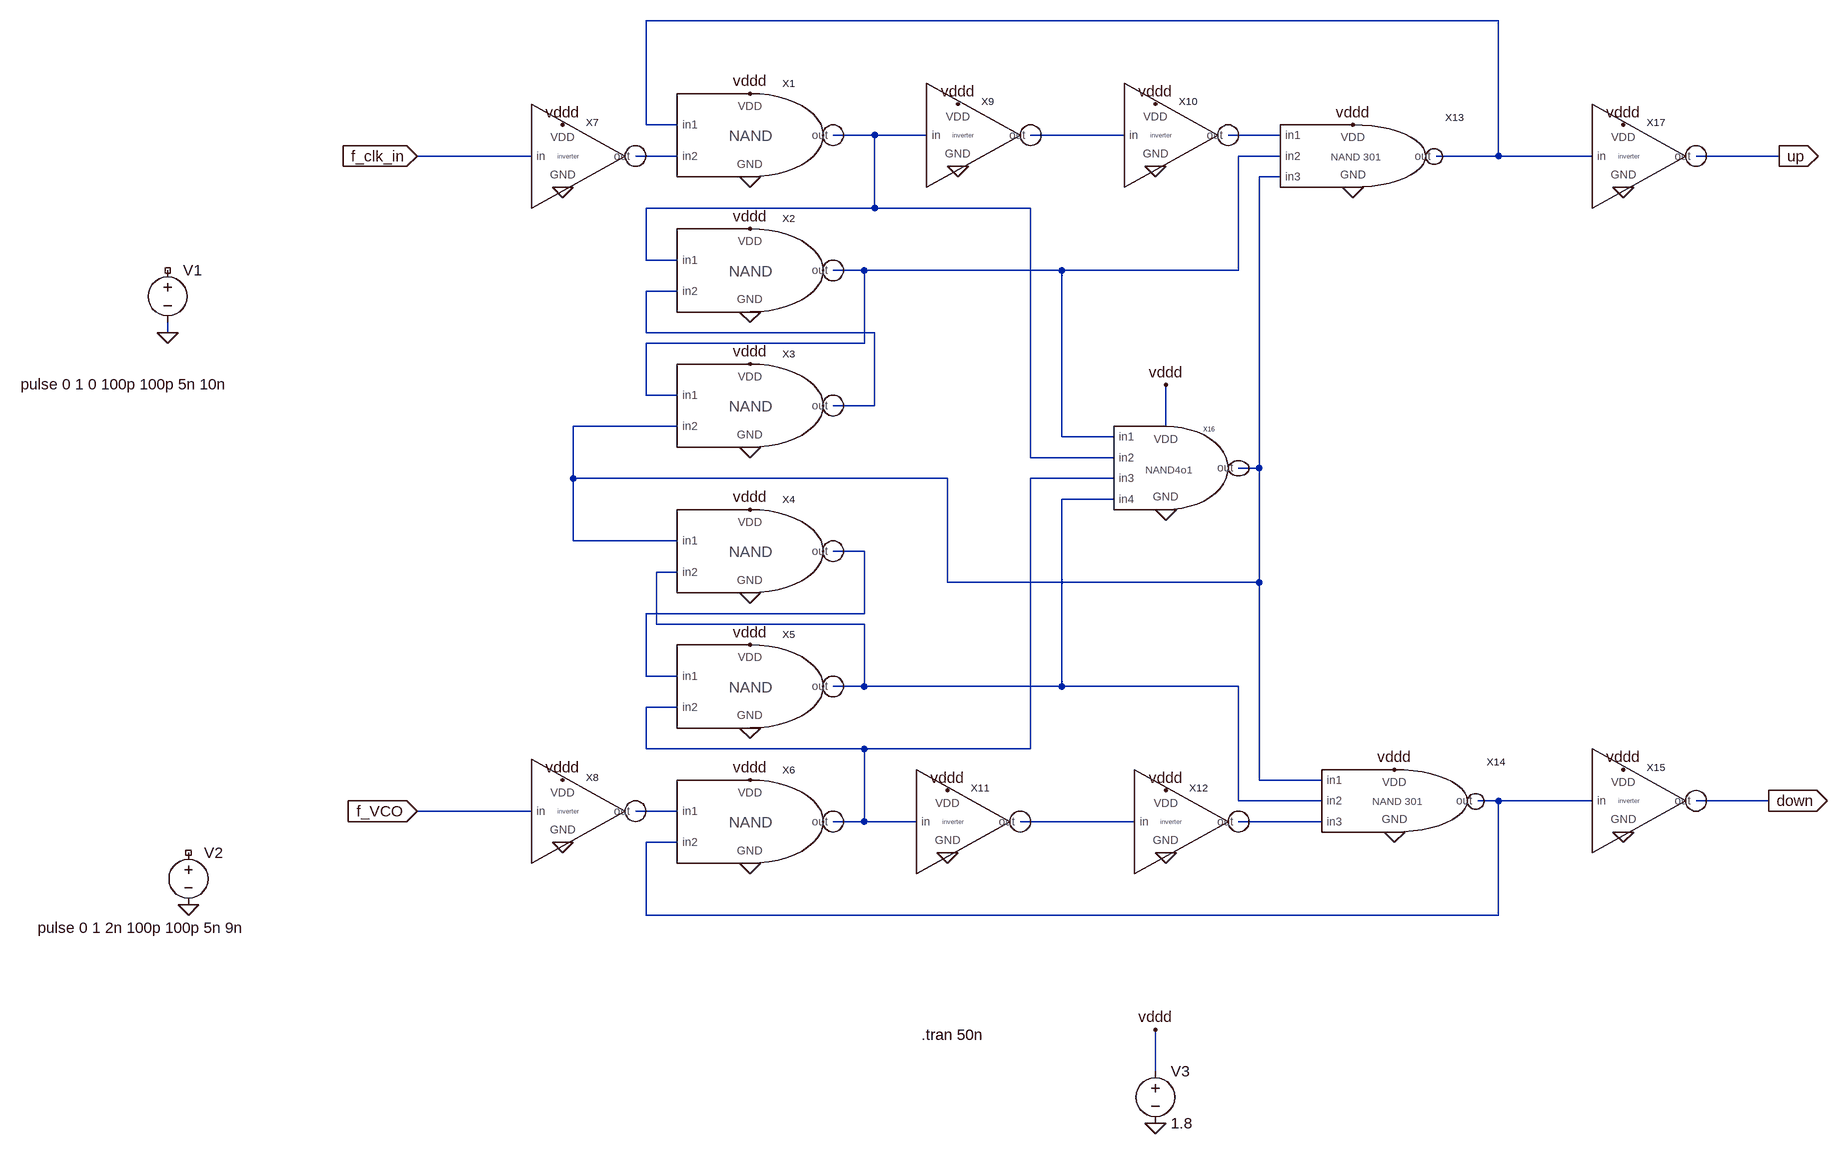
[diagram p0: schematic pfd_501.asc]
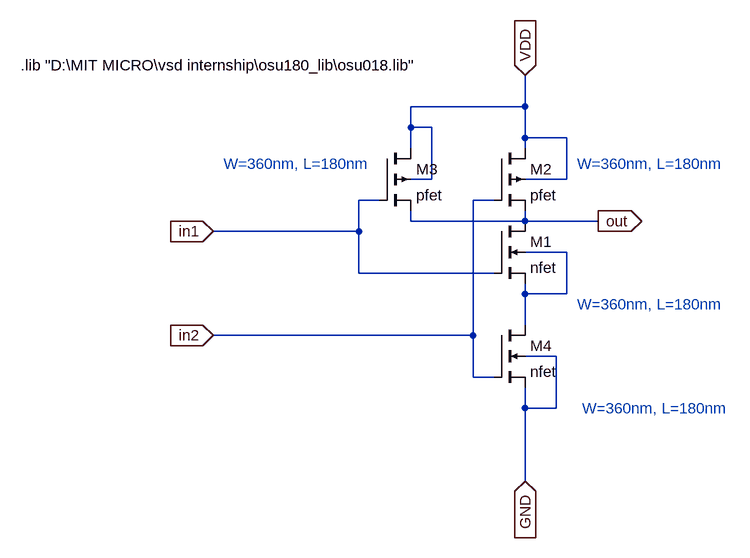
[diagram p1: sub-circuit nand101.asc]
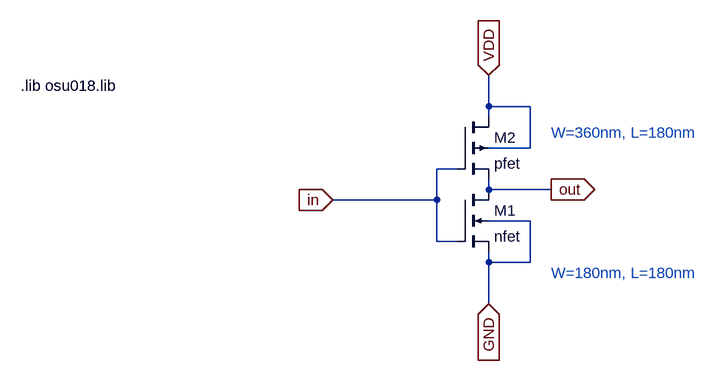
[diagram p2: sub-circuit inv101.asc]
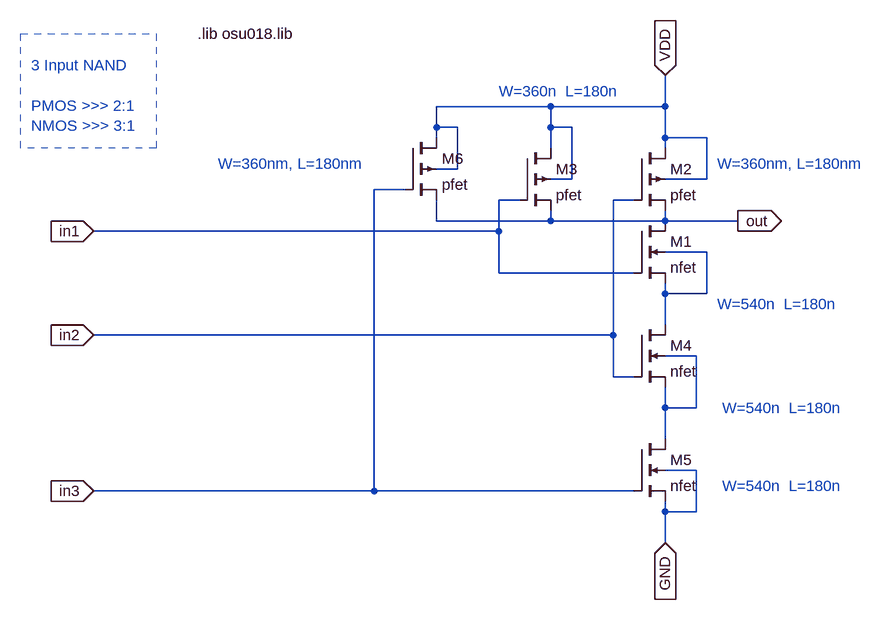
[diagram p3: sub-circuit nand301.asc]
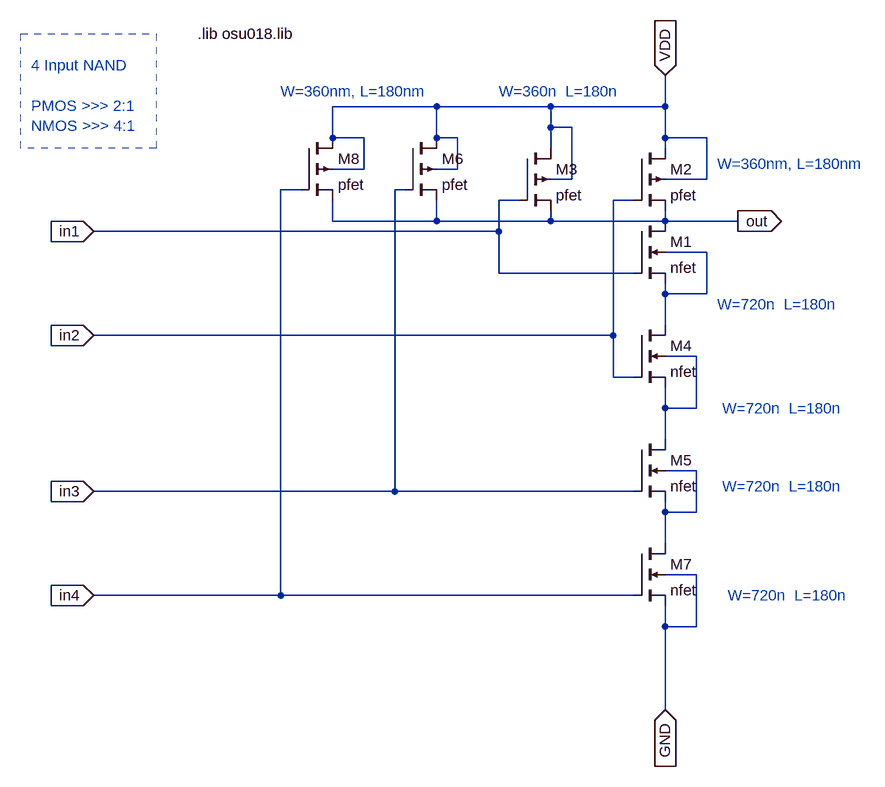
[diagram p4: sub-circuit nand401.asc]
pfd_501.asc, the LTspice schematic file:
Version 4
SHEET 1 2504 1444
WIRE 1248 -272 -64 -272
WIRE -64 -112 -64 -272
WIRE -16 -112 -64 -112
WIRE 288 -96 224 -96
WIRE 368 -96 288 -96
WIRE 672 -96 528 -96
WIRE 912 -96 832 -96
WIRE -240 -64 -416 -64
WIRE -16 -64 -80 -64
WIRE 912 -64 848 -64
WIRE 1248 -64 1248 -272
WIRE 1248 -64 1152 -64
WIRE 1392 -64 1248 -64
WIRE 1680 -64 1552 -64
WIRE 912 -32 880 -32
WIRE 288 16 288 -96
WIRE 288 16 -64 16
WIRE 528 16 288 16
WIRE -64 96 -64 16
WIRE -16 96 -64 96
WIRE 272 112 224 112
WIRE 576 112 272 112
WIRE 848 112 848 -64
WIRE 848 112 576 112
WIRE -16 144 -64 144
WIRE -800 208 -800 192
WIRE -64 208 -64 144
WIRE 288 208 -64 208
WIRE 272 224 272 112
WIRE 272 224 -64 224
WIRE -64 304 -64 224
WIRE -16 304 -64 304
WIRE 288 320 288 208
WIRE 288 320 224 320
WIRE -16 352 -176 352
WIRE 736 352 736 288
WIRE 576 368 576 112
WIRE 656 368 576 368
WIRE 528 400 528 16
WIRE 656 400 528 400
WIRE 880 416 880 -32
WIRE 880 416 848 416
WIRE -176 432 -176 352
WIRE 400 432 -176 432
WIRE 656 432 528 432
WIRE 656 464 576 464
WIRE -176 528 -176 432
WIRE -16 528 -176 528
WIRE 272 544 224 544
WIRE -16 576 -48 576
WIRE 400 592 400 432
WIRE 880 592 880 416
WIRE 880 592 400 592
WIRE 272 640 272 544
WIRE 272 640 -64 640
WIRE -48 656 -48 576
WIRE 272 656 -48 656
WIRE -64 736 -64 640
WIRE -16 736 -64 736
WIRE 272 752 272 656
WIRE 272 752 224 752
WIRE 576 752 576 464
WIRE 576 752 272 752
WIRE 848 752 576 752
WIRE -16 784 -64 784
WIRE -64 848 -64 784
WIRE 272 848 -64 848
WIRE 528 848 528 432
WIRE 528 848 272 848
WIRE 880 896 880 592
WIRE 976 896 880 896
WIRE 848 928 848 752
WIRE 976 928 848 928
WIRE 1248 928 1216 928
WIRE 1392 928 1248 928
WIRE 1664 928 1552 928
WIRE -240 944 -416 944
WIRE -16 944 -80 944
WIRE 272 960 272 848
WIRE 272 960 224 960
WIRE 352 960 272 960
WIRE 688 960 512 960
WIRE 976 960 848 960
WIRE -16 992 -64 992
WIRE -64 1104 -64 992
WIRE 1248 1104 1248 928
WIRE 1248 1104 -64 1104
WIRE 720 1344 720 1280
FLAG -416 -64 f_clk_in
IOPIN -416 -64 In
FLAG -416 944 f_VCO
IOPIN -416 944 In
FLAG 1680 -64 up
IOPIN 1680 -64 Out
FLAG 1664 928 down
IOPIN 1664 928 Out
FLAG -800 208 0
FLAG -768 1088 0
FLAG 1440 -16 0
FLAG 1024 -16 0
FLAG 720 -48 0
FLAG 416 -48 0
FLAG 96 -32 0
FLAG 96 176 0
FLAG 96 384 0
FLAG 96 608 0
FLAG -192 -16 0
FLAG 96 816 0
FLAG 96 1024 0
FLAG 400 1008 0
FLAG 736 1008 0
FLAG 1088 976 0
FLAG 1440 976 0
FLAG -192 992 0
FLAG -192 -112 vddd
FLAG 96 -160 vddd
FLAG 416 -144 vddd
FLAG 720 -144 vddd
FLAG 96 48 vddd
FLAG 1024 -112 vddd
FLAG 1440 -112 vddd
FLAG 736 288 vddd
FLAG 96 256 vddd
FLAG 96 480 vddd
FLAG 96 688 vddd
FLAG 96 896 vddd
FLAG 400 912 vddd
FLAG 736 912 vddd
FLAG 1088 880 vddd
FLAG -192 896 vddd
FLAG 1440 880 vddd
FLAG 720 1424 0
FLAG 720 1280 vddd
FLAG 736 480 0
SYMBOL nand101 64 -96 R0
SYMATTR InstName X1
SYMBOL nand101 64 112 R0
SYMATTR InstName X2
SYMBOL nand101 64 320 R0
SYMATTR InstName X3
SYMBOL nand101 64 544 R0
SYMATTR InstName X4
SYMBOL nand101 64 752 R0
SYMATTR InstName X5
SYMBOL nand101 64 960 R0
SYMATTR InstName X6
SYMBOL inv101 -192 -64 R0
SYMATTR InstName X7
SYMBOL inv101 -192 944 R0
SYMATTR InstName X8
SYMBOL inv101 416 -96 R0
SYMATTR InstName X9
SYMBOL inv101 720 -96 R0
SYMATTR InstName X10
SYMBOL inv101 400 960 R0
SYMATTR InstName X11
SYMBOL inv101 736 960 R0
SYMATTR InstName X12
SYMBOL nand301 976 -64 R0
SYMATTR InstName X13
SYMBOL nand301 1040 928 R0
SYMATTR InstName X14
SYMBOL inv101 1440 928 R0
SYMATTR InstName X15
SYMBOL nand401 720 400 R0
SYMATTR InstName X16
SYMBOL inv101 1440 -64 R0
SYMATTR InstName X17
SYMBOL voltage -800 96 R0
WINDOW 3 -226 191 Left 2
WINDOW 123 0 0 Left 0
WINDOW 39 0 0 Left 0
SYMATTR Value pulse 0 1 0 100p 100p 5n 10n
SYMATTR InstName V1
SYMBOL voltage -768 992 R0
WINDOW 3 -232 131 Left 2
WINDOW 123 0 0 Left 0
WINDOW 39 0 0 Left 0
SYMATTR Value pulse 0 1 2n 100p 100p 5n 9n
SYMATTR InstName V2
SYMBOL voltage 720 1328 R0
WINDOW 123 0 0 Left 0
WINDOW 39 0 0 Left 0
SYMATTR InstName V3
SYMATTR Value 1.8
TEXT 360 1288 Left 2 !.tran 50n

nand101.asc, the sub-circuit schematic file:
Version 4
SHEET 1 880 708
WIRE 272 0 272 -48
WIRE 272 0 96 0
WIRE 96 32 96 0
WIRE 128 32 96 32
WIRE 272 48 272 0
WIRE 336 48 272 48
WIRE 96 64 96 32
WIRE 272 64 272 48
WIRE 128 112 128 32
WIRE 128 112 96 112
WIRE 336 112 336 48
WIRE 336 112 272 112
WIRE 48 144 16 144
WIRE 224 144 192 144
WIRE 96 176 96 160
WIRE 272 176 272 160
WIRE 272 176 96 176
WIRE 384 176 272 176
WIRE 16 192 16 144
WIRE 16 192 -208 192
WIRE 336 224 272 224
WIRE 16 256 16 192
WIRE 224 256 16 256
WIRE 272 288 272 272
WIRE 336 288 336 224
WIRE 336 288 272 288
WIRE 272 336 272 288
WIRE 192 352 192 144
WIRE 192 352 -208 352
WIRE 320 384 272 384
WIRE 192 416 192 352
WIRE 224 416 192 416
WIRE 272 464 272 432
WIRE 320 464 320 384
WIRE 320 464 272 464
WIRE 272 576 272 464
FLAG 384 176 out
IOPIN 384 176 Out
FLAG -208 192 in1
IOPIN -208 192 In
FLAG 272 -48 VDD
IOPIN 272 -48 In
FLAG 272 576 GND
IOPIN 272 576 In
FLAG -208 352 in2
IOPIN -208 352 In
SYMBOL nmos4 224 176 R0
SYMATTR InstName M1
SYMATTR Value2 l=180n w=180n
SYMATTR Value nfet
SYMBOL pmos4 224 64 R0
SYMATTR InstName M2
SYMATTR Value2 l=180n w=360n
SYMATTR Value pfet
SYMBOL pmos4 48 64 R0
SYMATTR InstName M3
SYMATTR Value pfet
SYMATTR Value2 l=180n w=360n
SYMBOL nmos4 224 336 R0
SYMATTR InstName M4
SYMATTR Value nfet
SYMATTR Value2 l=180n w=360n
TEXT -504 -64 Left 2 !.lib "D:\\MIT MICRO\\vsd internship\\osu180_lib\\osu018.lib"
TEXT 352 304 Left 2 ;W=360nm, L=180nm
TEXT 352 88 Left 2 ;W=360nm, L=180nm
TEXT 360 464 Left 2 ;W=360nm, L=180nm
TEXT -192 88 Left 2 ;W=360nm, L=180nm

inv101.asc, the sub-circuit schematic file:
Version 4
SHEET 1 880 680
WIRE 256 48 256 0
WIRE 320 48 256 48
WIRE 256 64 256 48
WIRE 320 112 320 48
WIRE 320 112 256 112
WIRE 208 144 176 144
WIRE 256 176 256 160
WIRE 352 176 256 176
WIRE 176 192 176 144
WIRE 176 192 16 192
WIRE 320 224 256 224
WIRE 176 256 176 192
WIRE 208 256 176 256
WIRE 256 288 256 272
WIRE 320 288 320 224
WIRE 320 288 256 288
WIRE 256 352 256 288
FLAG 352 176 out
IOPIN 352 176 Out
FLAG 16 192 in
IOPIN 16 192 In
FLAG 256 0 VDD
IOPIN 256 0 In
FLAG 256 352 GND
IOPIN 256 352 In
SYMBOL nmos4 208 176 R0
SYMATTR InstName M1
SYMATTR Value2 l=180n w=180n
SYMATTR Value nfet
SYMBOL pmos4 208 64 R0
SYMATTR InstName M2
SYMATTR Value2 l=180n w=360n
SYMATTR Value pfet
TEXT -464 16 Left 2 !.lib osu018.lib
TEXT 352 304 Left 2 ;W=180nm, L=180nm
TEXT 352 88 Left 2 ;W=360nm, L=180nm

nand301.asc, the sub-circuit schematic file:
Version 4
SHEET 1 916 896
WIRE 96 0 -80 0
WIRE 272 0 272 -48
WIRE 272 0 96 0
WIRE -80 32 -80 0
WIRE -48 32 -80 32
WIRE 96 32 96 0
WIRE 128 32 96 32
WIRE -80 48 -80 32
WIRE 272 48 272 0
WIRE 336 48 272 48
WIRE 96 64 96 32
WIRE 272 64 272 48
WIRE -48 96 -48 32
WIRE -48 96 -80 96
WIRE 128 112 128 32
WIRE 128 112 96 112
WIRE 336 112 336 48
WIRE 336 112 272 112
WIRE -128 128 -176 128
WIRE 48 144 16 144
WIRE 224 144 192 144
WIRE -80 176 -80 144
WIRE 96 176 96 160
WIRE 96 176 -80 176
WIRE 272 176 272 160
WIRE 272 176 96 176
WIRE 384 176 272 176
WIRE 16 192 16 144
WIRE 16 192 -608 192
WIRE 336 224 272 224
WIRE 16 256 16 192
WIRE 224 256 16 256
WIRE 272 288 272 272
WIRE 336 288 336 224
WIRE 336 288 272 288
WIRE 272 336 272 288
WIRE 192 352 192 144
WIRE 192 352 -608 352
WIRE 320 384 272 384
WIRE 192 416 192 352
WIRE 224 416 192 416
WIRE 272 464 272 432
WIRE 320 464 320 384
WIRE 320 464 272 464
WIRE 272 512 272 464
WIRE 320 560 272 560
WIRE -176 592 -176 128
WIRE -176 592 -608 592
WIRE 224 592 -176 592
WIRE 272 624 272 608
WIRE 320 624 320 560
WIRE 320 624 272 624
WIRE 272 672 272 624
FLAG 384 176 out
IOPIN 384 176 Out
FLAG -608 192 in1
IOPIN -608 192 In
FLAG 272 -48 VDD
IOPIN 272 -48 In
FLAG 272 672 GND
IOPIN 272 672 In
FLAG -608 352 in2
IOPIN -608 352 In
FLAG -608 592 in3
IOPIN -608 592 In
SYMBOL nmos4 224 176 R0
SYMATTR InstName M1
SYMATTR Value2 l=180n w=540n
SYMATTR Value nfet
SYMBOL pmos4 224 64 R0
SYMATTR InstName M2
SYMATTR Value2 l=180n w=360n
SYMATTR Value pfet
SYMBOL pmos4 48 64 R0
SYMATTR InstName M3
SYMATTR Value pfet
SYMATTR Value2 l=180n w=360n
SYMBOL nmos4 224 336 R0
SYMATTR InstName M4
SYMATTR Value nfet
SYMATTR Value2 l=180n w=540n
SYMBOL nmos4 224 512 R0
SYMATTR InstName M5
SYMATTR Value nfet
SYMATTR Value2 l=180n w=540n
SYMBOL pmos4 -128 48 R0
SYMATTR InstName M6
SYMATTR Value pfet
SYMATTR Value2 l=180n w=360n
TEXT -448 -112 Left 2 !.lib osu018.lib
TEXT 352 304 Left 2 ;W=540n  L=180n
TEXT 352 88 Left 2 ;W=360nm, L=180nm
TEXT 360 464 Left 2 ;W=540n  L=180n
TEXT -416 88 Left 2 ;W=360nm, L=180nm
TEXT 360 584 Left 2 ;W=540n  L=180n
TEXT 16 -24 Left 2 ;W=360n  L=180n
TEXT -704 -64 Left 2 ;3 Input NAND\n \nPMOS >>> 2:1\nNMOS >>> 3:1
RECTANGLE Normal -512 64 -720 -112 2

nand401.asc, the sub-circuit schematic file:
Version 4
SHEET 1 916 1040
WIRE -80 0 -240 0
WIRE 96 0 -80 0
WIRE 272 0 272 -48
WIRE 272 0 96 0
WIRE 96 32 96 0
WIRE 128 32 96 32
WIRE -240 48 -240 0
WIRE -192 48 -240 48
WIRE -80 48 -80 0
WIRE -48 48 -80 48
WIRE 272 48 272 0
WIRE 336 48 272 48
WIRE 96 64 96 32
WIRE 272 64 272 48
WIRE -192 96 -192 48
WIRE -192 96 -240 96
WIRE -48 96 -48 48
WIRE -48 96 -80 96
WIRE 128 112 128 32
WIRE 128 112 96 112
WIRE 336 112 336 48
WIRE 336 112 272 112
WIRE -288 128 -320 128
WIRE -128 128 -144 128
WIRE 48 144 16 144
WIRE 224 144 192 144
WIRE -240 176 -240 144
WIRE -80 176 -80 144
WIRE -80 176 -240 176
WIRE 96 176 96 160
WIRE 96 176 -80 176
WIRE 272 176 272 160
WIRE 272 176 96 176
WIRE 384 176 272 176
WIRE 16 192 16 144
WIRE 16 192 -608 192
WIRE 336 224 272 224
WIRE 16 256 16 192
WIRE 224 256 16 256
WIRE 272 288 272 272
WIRE 336 288 336 224
WIRE 336 288 272 288
WIRE 272 336 272 288
WIRE 192 352 192 144
WIRE 192 352 -608 352
WIRE 320 384 272 384
WIRE 192 416 192 352
WIRE 224 416 192 416
WIRE 272 464 272 432
WIRE 320 464 320 384
WIRE 320 464 272 464
WIRE 272 512 272 464
WIRE 320 560 272 560
WIRE -144 592 -144 128
WIRE -144 592 -608 592
WIRE 224 592 -144 592
WIRE 272 624 272 608
WIRE 320 624 320 560
WIRE 320 624 272 624
WIRE 272 672 272 624
WIRE 320 720 272 720
WIRE -320 752 -320 128
WIRE -320 752 -608 752
WIRE 224 752 -320 752
WIRE 272 800 272 768
WIRE 320 800 320 720
WIRE 320 800 272 800
WIRE 272 928 272 800
FLAG 384 176 out
IOPIN 384 176 Out
FLAG -608 192 in1
IOPIN -608 192 In
FLAG 272 -48 VDD
IOPIN 272 -48 In
FLAG 272 928 GND
IOPIN 272 928 In
FLAG -608 352 in2
IOPIN -608 352 In
FLAG -608 592 in3
IOPIN -608 592 In
FLAG -608 752 in4
IOPIN -608 752 In
SYMBOL nmos4 224 176 R0
SYMATTR InstName M1
SYMATTR Value2 l=180n w=720n
SYMATTR Value nfet
SYMBOL pmos4 224 64 R0
SYMATTR InstName M2
SYMATTR Value2 l=180n w=360n
SYMATTR Value pfet
SYMBOL pmos4 48 64 R0
SYMATTR InstName M3
SYMATTR Value pfet
SYMATTR Value2 l=180n w=360n
SYMBOL nmos4 224 336 R0
SYMATTR InstName M4
SYMATTR Value nfet
SYMATTR Value2 l=180n w=720n
SYMBOL nmos4 224 512 R0
SYMATTR InstName M5
SYMATTR Value nfet
SYMATTR Value2 l=180n w=720n
SYMBOL pmos4 -128 48 R0
SYMATTR InstName M6
SYMATTR Value pfet
SYMATTR Value2 l=180n w=360n
SYMBOL nmos4 224 672 R0
SYMATTR InstName M7
SYMATTR Value nfet
SYMATTR Value2 l=180n w=720n
SYMBOL pmos4 -288 48 R0
SYMATTR InstName M8
SYMATTR Value pfet
SYMATTR Value2 l=180n w=360n
TEXT -448 -112 Left 2 !.lib osu018.lib
TEXT 352 304 Left 2 ;W=720n  L=180n
TEXT 352 88 Left 2 ;W=360nm, L=180nm
TEXT 360 464 Left 2 ;W=720n  L=180n
TEXT -320 -24 Left 2 ;W=360nm, L=180nm
TEXT 360 584 Left 2 ;W=720n  L=180n
TEXT 16 -24 Left 2 ;W=360n  L=180n
TEXT -704 -64 Left 2 ;4 Input NAND\n \nPMOS >>> 2:1\nNMOS >>> 4:1
TEXT 368 752 Left 2 ;W=720n  L=180n
RECTANGLE Normal -512 64 -720 -112 2

The netlist it stands for:
* pfd_501.asc
XX1 N001 N005 N002 vddd 0 nand101
XX2 N002 N008 N006 vddd 0 nand101
XX3 N006 N007 N008 vddd 0 nand101
XX4 N007 N010 N011 vddd 0 nand101
XX5 N011 N009 N010 vddd 0 nand101
XX6 N013 N012 N009 vddd 0 nand101
XX7 f_clk_in N005 vddd 0 inv101
XX8 f_VCO N013 vddd 0 inv101
XX9 N002 N003 vddd 0 inv101
XX10 N003 N004 vddd 0 inv101
XX11 N009 N014 vddd 0 inv101
XX12 N014 N015 vddd 0 inv101
XX13 N004 N006 N007 N001 vddd 0 nand301
XX14 N007 N010 N015 N012 vddd 0 nand301
XX15 N012 down vddd 0 inv101
XX16 N006 N002 N009 N010 vddd 0 N007 nand401
XX17 N001 up vddd 0 inv101
V1 NC_01 0 pulse 0 1 0 100p 100p 5n 10n
V2 NC_02 0 pulse 0 1 2n 100p 100p 5n 9n
V3 vddd 0 1.8

* block symbol definitions
.subckt nand101 in1 in2 out VDD GND
M1 out in1 N001 N001 nfet l=180n w=180n
M2 VDD in2 out VDD pfet l=180n w=360n
M3 VDD in1 out VDD pfet l=180n w=360n
M4 N001 in2 GND GND nfet l=180n w=360n
.lib "D:\MIT MICRO\vsd internship\osu180_lib\osu018.lib"
* W=360nm, L=180nm
* W=360nm, L=180nm
* W=360nm, L=180nm
* W=360nm, L=180nm
.ends nand101

.subckt inv101 in out VDD GND
M1 out in GND GND nfet l=180n w=180n
M2 VDD in out VDD pfet l=180n w=360n
.lib osu018.lib
* W=180nm, L=180nm
* W=360nm, L=180nm
.ends inv101

.subckt nand301 in1 in2 in3 out VDD GND
M1 out in1 N001 N001 nfet l=180n w=540n
M2 VDD in2 out VDD pfet l=180n w=360n
M3 VDD in1 out VDD pfet l=180n w=360n
M4 N001 in2 N002 N002 nfet l=180n w=540n
M5 N002 in3 GND GND nfet l=180n w=540n
M6 VDD in3 out VDD pfet l=180n w=360n
.lib osu018.lib
* W=540n  L=180n
* W=360nm, L=180nm
* W=540n  L=180n
* W=360nm, L=180nm
* W=540n  L=180n
* W=360n  L=180n
* 3 Input NAND
* PMOS >>> 2:1
* NMOS >>> 3:1
.ends nand301

.subckt nand401 in1 in2 in3 in4 VDD GND out
M1 out in1 N001 N001 nfet l=180n w=720n
M2 VDD in2 out VDD pfet l=180n w=360n
M3 VDD in1 out VDD pfet l=180n w=360n
M4 N001 in2 N002 N002 nfet l=180n w=720n
M5 N002 in3 N003 N003 nfet l=180n w=720n
M6 VDD in3 out VDD pfet l=180n w=360n
M7 N003 in4 GND GND nfet l=180n w=720n
M8 VDD in4 out VDD pfet l=180n w=360n
.lib osu018.lib
* W=720n  L=180n
* W=360nm, L=180nm
* W=720n  L=180n
* W=360nm, L=180nm
* W=720n  L=180n
* W=360n  L=180n
* 4 Input NAND
* PMOS >>> 2:1
* NMOS >>> 4:1
* W=720n  L=180n
.ends nand401

.model NMOS NMOS
.model PMOS PMOS
.lib standard.mos
.tran 50n
.backanno
.end